# Altium schematic sheet Sheet-ThermalType-STM32.SchDoc
size A4
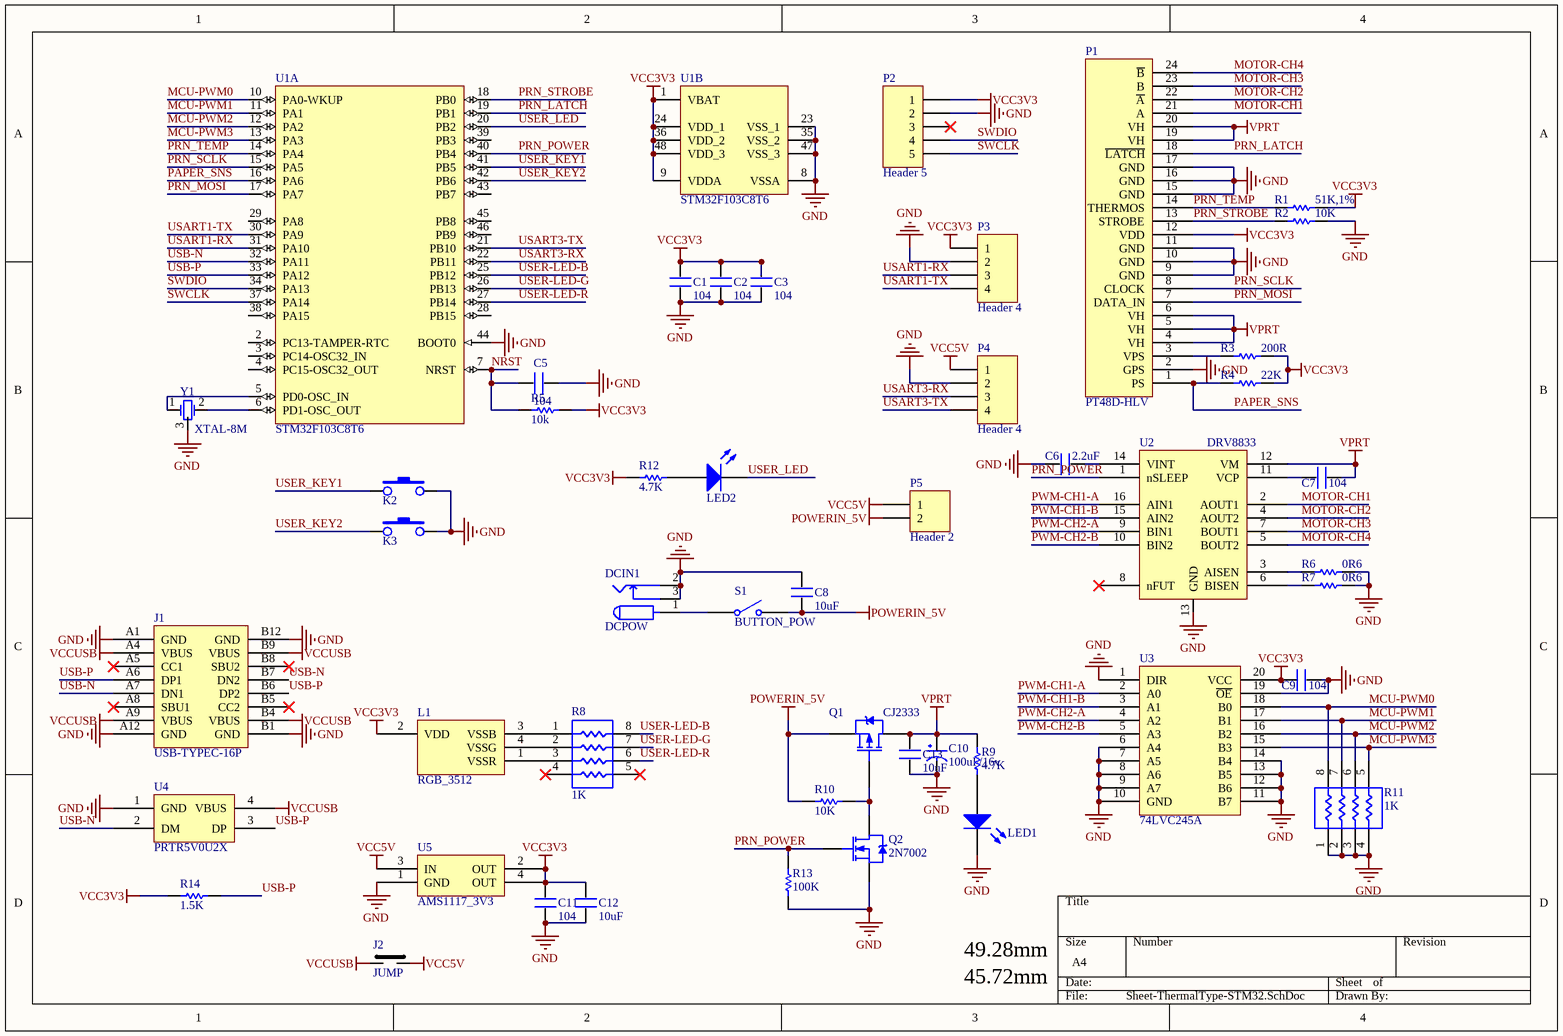
[diagram p0: Sheet-ThermalType-STM32.SchDoc]

## Parts
C1  104  [0603c]
C2  104  [0603c]
C3  104  [0603c]
C5  104  [0603c]
C6  2.2uF  [0603C]
C7  104  [0603C]
C8  10uF  [0603C]
C9  104  [0603C]
C10  100uF/16v  [ECAP_V]
C11  104  [0603C]
C12  10uF  [0603C]
C13  10uF  [0603C]
DCIN1  DCPOW  [DC10B]
J1  USB-TYPEC-16P  [USB-TYPEC-16P]
J2  JUMP  [JUMP]
K2  侧脚6*6*X微动按键  [侧脚6*6*X微动按键]  (value not drawn)
K3  侧脚6*6*X微动按键  [侧脚6*6*X微动按键]  (value not drawn)
L1  RGB_3512  [RGB_3528]
LED1  0603LED  [0603LED]  (value not drawn)
LED2  0603LED  [0603LED]  (value not drawn)
P1  PT48D-HLV  [_FPC_24P_0.5MM]
P2  Header 5  [sh1.25_LT_5P]
P3  Header 4  [SH1.25_LT_4P]
P4  Header 4  [SH1.25_LT_4P]
P5  Header 2  [HDR1X2]
Q1  CJ2333  [CJ2333]
Q2  2N7002  [2N7002]
R1  51K,1%  [0603r]
R2  10K  [0603r]
R3  200R  [0603r]
R4  22K  [0603r]
R5  10k  [0603r]
R6  0R6  [0805R]
R7  0R6  [0805R]
R8  1K  [0603RES]
R9  4.7K  [0603r]
R10  10K  [0603r]
R11  1K  [0603RES]
R12  4.7K  [0603r]
R13  100K  [0603r]
R14  1.5K  [0603r]
S1  BUTTON_POW  [拨动开关SS-12D]
U1  STM32F103C8T6  [STM-LQFP48-L]  (parts A,B of 2)
U2  DRV8833  [DRV8833]
U3  74LVC245A  [TSSOP20]
U4  PRTR5V0U2X  [SOT-143]
U5  AMS1117_3V3  [AMS1117_SOT223]
Y1  XTAL-8M  [XTAL_8M]

## Nets
GND: C1.1 C2.1 C3.1 C5.2 C6.1 C8.2 C9.2 C10.2(GND) C11.1 C12.1 C13.1 DCIN1.2 DCIN1.3 J1.A1(GND) J1.A12(GND) J1.B1(GND) J1.B12(GND) K2.1 K3.1 LED1.2(K) P1.2(GPS) P1.9(GND) P1.10(GND) P1.11(GND) P1.15(GND) P1.16(GND) P1.17(GND) P2.2 P3.2 P4.2 Q2.2(S) R2.2 R6.2 R7.2 R11.1 R11.2 R11.3 R11.4 R13.1 U1.8(VSSA) U1.23(VSS_1) U1.35(VSS_2) U1.44(BOOT0) U1.47(VSS_3) U2.13(GND) U3.1(DIR) U3.6(A4) U3.7(A5) U3.8(A6) U3.9(A7) U3.10(GND) U3.11(B7) U3.12(B6) U3.13(B5) U3.14(B4) U3.19(~{OE}) U4.1(GND) U5.1(GND) Y1.3
POWERIN_5V: C8.1 P5.2 Q1.3(S) R10.1 S1.3(NO)
VCC3V3: C1.2 C2.2 C3.2 C9.1 C11.2 C12.2 L1.2(VDD) P1.12(VDD) P2.1 P3.1 R1.2 R3.2 R4.2 R5.2 R12.2 R14.1 U1.1(VBAT) U1.9(VDDA) U1.24(VDD_1) U1.36(VDD_2) U1.48(VDD_3) U3.20(VCC) U5.2(OUT) U5.4(OUT)
VCC5V: J2.2 P4.1 P5.1 U5.3(IN)
VCCUSB: J1.A4(VBUS) J1.A9(VBUS) J1.B4(VBUS) J1.B9(VBUS) J2.1 U4.4(VBUS)
VPRT: C7.2 C10.1(VCC) C13.2 P1.4(VH) P1.5(VH) P1.6(VH) P1.19(VH) P1.20(VH) Q1.2(D) R9.2 U2.12(VM)
MCU-PWM0: R11.8 U1.10(PA0-WKUP) U3.18(B0)
MCU-PWM1: R11.7 U1.11(PA1) U3.17(B1)
MCU-PWM2: R11.6 U1.12(PA2) U3.16(B2)
MCU-PWM3: R11.5 U1.13(PA3) U3.15(B3)
MOTOR-CH1: P1.21(A) U2.2(AOUT1)
MOTOR-CH2: P1.22(~{A}) U2.4(AOUT2)
MOTOR-CH3: P1.23(B) U2.7(BOUT1)
MOTOR-CH4: P1.24(~{B}) U2.5(BOUT2)
NRST: C5.1 R5.1 U1.7(NRST)
PAPER_SNS: P1.1(PS) R4.1 U1.16(PA6)
PRN_LATCH: P1.18(~{LATCH}) U1.19(PB1)
PRN_MOSI: P1.7(DATA_IN) U1.17(PA7)
PRN_POWER: Q2.1(G) R13.2 U1.40(PB4) U2.1(nSLEEP)
PRN_SCLK: P1.8(CLOCK) U1.15(PA5)
PRN_STROBE: P1.13(STROBE) R2.1 U1.18(PB0)
PRN_TEMP: P1.14(THERMOS) R1.1 U1.14(PA4)
PWM-CH1-A: U2.16(AIN1) U3.2(A0)
PWM-CH1-B: U2.15(AIN2) U3.3(A1)
PWM-CH2-A: U2.9(BIN1) U3.4(A2)
PWM-CH2-B: U2.10(BIN2) U3.5(A3)
SWCLK: P2.5 U1.37(PA14)
SWDIO: P2.4 U1.34(PA13)
USART1-RX: P3.3 U1.31(PA10)
USART1-TX: P3.4 U1.30(PA9)
USART3-RX: P4.3 U1.22(PB11)
USART3-TX: P4.4 U1.21(PB10)
USB-N: J1.A7(DN1) J1.B7(DN2) U1.32(PA11) U4.2(DM)
USB-P: J1.A6(DP1) J1.B6(DP2) R14.2 U1.33(PA12) U4.3(DP)
USER-LED-B: R8.8 U1.25(PB12)
USER-LED-G: R8.7 U1.26(PB13)
USER-LED-R: R8.6 U1.27(PB14)
USER_KEY1: K2.2 U1.41(PB5)
USER_KEY2: K3.2 U1.42(PB6)
USER_LED: LED2.2(K) U1.20(PB2)
NetC6_2: C6.2 U2.14(VINT)
NetC7_1: C7.1 U2.11(VCP)
NetDCIN1_1: DCIN1.1 S1.2(COMMON)
NetL1_1: L1.1(VSSR) R8.3
NetL1_3: L1.3(VSSB) R8.1
NetL1_4: L1.4(VSSG) R8.2
NetLED1_1: LED1.1(A) R9.1
NetLED2_1: LED2.1(A) R12.1
NetP1_3: P1.3(VPS) R3.1
NetQ1_1: Q1.1(G) Q2.3(D) R10.2
NetR6_1: R6.1 U2.3(AISEN)
NetR7_1: R7.1 U2.6(BISEN)
NetU1_5: U1.5(PD0-OSC_IN) Y1.1(OSC1)
NetU1_6: U1.6(PD1-OSC_OUT) Y1.2(OSC2)

Not connected (* = marked no-connect by the designer): J1 A5(CC1)* A8(SBU1)* B5(CC2)* B8(SBU2)*; P2 3*; R8 4* 5*; U1 2(PC13-TAMPER-RTC) 3(PC14-OSC32_IN) 4(PC15-OSC32_OUT) 28(PB15) 29(PA8) 38(PA15) 39(PB3) 43(PB7) 45(PB8) 46(PB9); U2 8(nFUT)*

## Notes on the sheet
- 49.28mm
- 45.72mm

## Library data of the parts
C1-C3 C5 = 0603c
C6 C7 C9 = 0603C: 电容
C8 C11-C13 = 0603C
C10 = ECAP: 电容
DCIN1 = DCPOW: DC电源头
P2 = Header 5: Header, 5-Pin; LatestRevisionDate: 17-Jul-2002; LatestRevisionNote: Re-released for DXP Platform.; Publisher: Altium Limited
P3 P4 = Header 4: Header, 4-Pin; LatestRevisionDate: 17-Jul-2002; LatestRevisionNote: Re-released for DXP Platform.; Publisher: Altium Limited
P5 = Header 2: Header, 2-Pin; LatestRevisionDate: 17-Jul-2002; LatestRevisionNote: Re-released for DXP Platform.; Publisher: Altium Limited
Q1 = CJ2333: P-MOS
Q2 = NMOS-2: N-Channel Power MOSFET; Note: Pin 2 is electrically connected to pin 4.; Published: 8-Jun-2000; LatestRevisionDate: 17-Jul-2002; LatestRevisionNote: Re-released for DXP Platform.; DatasheetDocument: PD-9.814; PackageReference: TO-220AB; Publisher: Altium Limited; Code_JEDEC: TO-220-AB; ComponentLink1Description: Manufacturer Link; ComponentLink1URL: http://www.irf.com/
R1-R4 R10 R13 = 0603R: 电阻
R5 = 0603r
R6 R7 = 0805R: 电阻
R8 = 0603RES
R9 R12 R14 = 0603R
R11 = 0603RES: 排阻
S1 = 自锁开关
U1 = STM32F103C8T6: ARM Cortex-M3 32-bit MCU, 64 KB Flash, 20 KB Internal RAM, 37 I/Os, 48-pin LQFP, -40 to 85 degC, Tray; A/D Converter: 2x12-bit (10 Channel); FLASH Size (Prog) (kB): 64; I/Os (High Current): 37; Internal RAM Size (kB): 20; Operating Frequency(F) (Processor speed) (MHz): 72; Supply Voltage(Vcc) min (V): 2; DatasheetVersion: Rev. 16; PackageVersion: Rev. 6, 06/2013; PackageReference: LQFP48; PackageDescription: 48-Pin Low Profile Quad Flat Package, 7 x 7 mm Body, 0.5 mm Pitch; Supplier 1: Digi-Key; Supplier Part Number 1: 497-6063-ND; Supplier 2: Farnell; Supplier Part Number 2: 1447637; Supplier 3: Newark; Supplier Part Number 3: 59M2182; Supplier 4: Newark; Supplier Part Number 4: 57P1222; Supplier 5: Mouser; Supplier Part Number 5: 511-STM32F103C8T6; Core: ARM Cortex-M3; Packing: Tray; Mounting Technology: Surface Mount; PartNumber: STM32F103C8T6; ComponentLink1Description: Manufacturer URL; ComponentLink1URL: http://www.st.com/web/en/home.html; ComponentLink2Description: Datasheet; ComponentLink2URL: http://www.st.com/st-web-ui/static/active/en/resource/technical/document/datasheet/CD00161566.pdf; ComponentLink3Description: Package Specification; ComponentLink3URL: http://www.st.com/st-web-ui/static/active/en/resource/technical/document/datasheet/DM00058181.pdf
U3 = 74LVC245A: 8通道隔离芯片
U4 = PRTR5V0U2X: 超低容值轨对轨静电放电保护二极管,主要保护两条高速数据或者高频率信号线免受静电放电和其他瞬变的影响
U5 = AMS1117
Y1 = XTAL-8M: 晶振